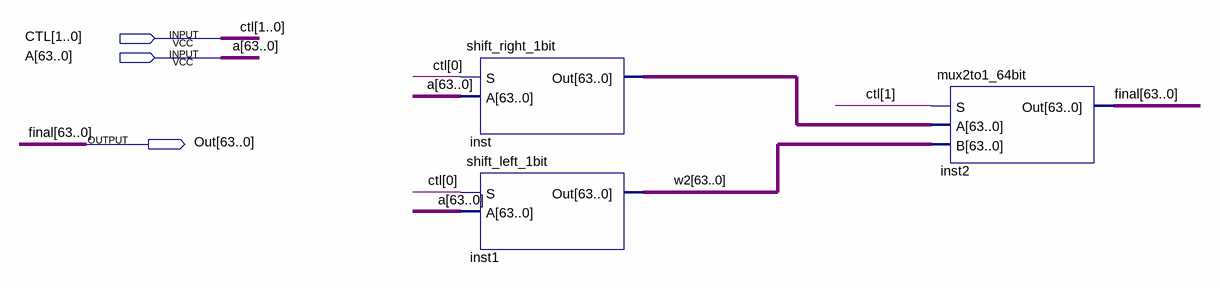
[diagram p0: schematic sheet]
// Quartus schematic shift_controller.bdf as structural Verilog: 3 symbols, 3 pins
module shift_controller (
  input  [1:0] CTL,
  input  [63:0] A,
  output [63:0] Out
);

  wire [63:0] inst_out, w2;

  shift_right_1bit inst (.S(CTL[0]), .A(A), .Out(inst_out));
  shift_left_1bit inst1 (.S(CTL[0]), .A(A), .Out(w2));
  mux2to1_64bit inst2 (.S(CTL[1]), .A(inst_out), .B(w2), .Out(Out));

  // Other names for the same wires on the sheet: final[63:0] = Out
endmodule
